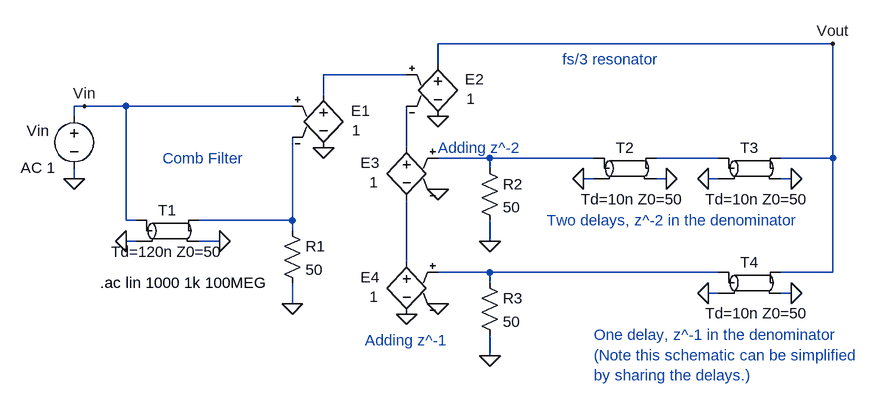
[diagram p0: schematic _Fig4_22_K_is_12_fs_3_AC_MSD.asc]
_Fig4_22_K_is_12_fs_3_AC_MSD.asc, the LTspice schematic file:
Version 4
SHEET 1 1468 728
WIRE 1360 208 752 208
WIRE 752 240 752 208
WIRE 704 256 576 256
WIRE 576 288 576 256
WIRE 208 304 192 304
WIRE 272 304 208 304
WIRE 528 304 272 304
WIRE 192 320 192 304
WIRE 704 368 704 304
WIRE 832 384 752 384
WIRE 992 384 832 384
WIRE 1184 384 1088 384
WIRE 1360 384 1360 208
WIRE 1360 384 1280 384
WIRE 832 400 832 384
WIRE 192 416 192 400
WIRE 992 416 976 416
WIRE 1104 416 1088 416
WIRE 1184 416 1168 416
WIRE 1296 416 1280 416
WIRE 272 480 272 304
WIRE 288 480 272 480
WIRE 528 480 528 352
WIRE 528 480 384 480
WIRE 528 496 528 480
WIRE 288 512 272 512
WIRE 416 512 384 512
WIRE 832 512 832 480
WIRE 704 544 704 448
WIRE 832 560 752 560
WIRE 1184 560 832 560
WIRE 1360 560 1360 384
WIRE 1360 560 1280 560
WIRE 832 576 832 560
WIRE 1184 592 1168 592
WIRE 1296 592 1280 592
WIRE 528 608 528 576
WIRE 832 688 832 656
FLAG 528 608 0
FLAG 416 512 0
FLAG 272 512 0
FLAG 192 416 0
FLAG 208 304 Vin
FLAG 576 368 0
FLAG 832 512 0
FLAG 1104 416 0
FLAG 976 416 0
FLAG 1360 208 Vout
FLAG 752 320 0
FLAG 1296 416 0
FLAG 1168 416 0
FLAG 752 432 0
FLAG 1296 592 0
FLAG 1168 592 0
FLAG 704 624 0
FLAG 752 608 0
FLAG 832 688 0
SYMBOL tline 336 496 R0
SYMATTR InstName T1
SYMATTR Value Td=120n Z0=50
SYMBOL res 512 480 R0
SYMATTR InstName R1
SYMATTR Value 50
SYMBOL voltage 192 304 R0
WINDOW 0 -73 38 Left 0
WINDOW 123 -82 95 Left 0
WINDOW 39 0 0 Left 0
SYMATTR InstName Vin
SYMATTR Value2 AC 1
SYMATTR Value ""
SYMBOL e 576 272 R0
WINDOW 0 42 39 Left 0
WINDOW 3 44 69 Left 0
SYMATTR InstName E1
SYMATTR Value 1
SYMBOL tline 1040 400 R0
WINDOW 3 -68 47 Left 0
SYMATTR Value Td=10n Z0=50
SYMATTR InstName T2
SYMBOL res 816 384 R0
SYMATTR InstName R2
SYMATTR Value 50
SYMBOL e 752 224 R0
WINDOW 0 42 39 Left 0
WINDOW 3 44 69 Left 0
SYMATTR InstName E2
SYMATTR Value 1
SYMBOL e 704 352 M0
WINDOW 0 42 39 Left 0
WINDOW 3 44 69 Left 0
SYMATTR InstName E3
SYMATTR Value 1
SYMBOL tline 1232 400 R0
WINDOW 3 -68 47 Left 0
SYMATTR Value Td=10n Z0=50
SYMATTR InstName T3
SYMBOL tline 1232 576 R0
WINDOW 3 -68 47 Left 0
SYMATTR Value Td=10n Z0=50
SYMATTR InstName T4
SYMBOL e 704 528 M0
WINDOW 0 42 39 Left 0
WINDOW 3 44 69 Left 0
SYMATTR InstName E4
SYMATTR Value 1
SYMBOL res 816 560 R0
SYMATTR InstName R3
SYMATTR Value 50
TEXT 232 576 Left 0 !.ac lin 1000 1k 100MEG
TEXT 328 384 Left 0 ;Comb Filter
TEXT 944 232 Left 0 ;fs/3 resonator
TEXT 920 480 Left 0 ;Two delays, z^-2 in the denominator
TEXT 992 656 Left 0 ;One delay, z^-1 in the denominator\n(Note this schematic can be simplified\nby sharing the delays.)
TEXT 640 664 Left 0 ;Adding z^-1
TEXT 752 368 Left 0 ;Adding z^-2

The netlist it stands for:
* _Fig4_22_K_is_12_fs_3_AC_MSD.asc
T1 Vin 0 N005 0 Td=120n Z0=50
R1 N005 0 50
Vin Vin 0 AC 1
E1 N001 0 Vin N005 1
T2 N003 0 N004 0 Td=10n Z0=50
R2 N003 0 50
E2 Vout 0 N001 N002 1
E3 N002 N006 N003 0 1
T3 N004 0 Vout 0 Td=10n Z0=50
T4 N007 0 Vout 0 Td=10n Z0=50
E4 N006 0 N007 0 1
R3 N007 0 50
.ac lin 1000 1k 100MEG
* Comb Filter
* fs/3 resonator
* Two delays, z^-2 in the denominator
* One delay, z^-1 in the denominator
* (Note this schematic can be simplified
* by sharing the delays.)
* Adding z^-1
* Adding z^-2
.backanno
.end